# EAGLE schematic Test Machines (EAGLE 9.6.2)
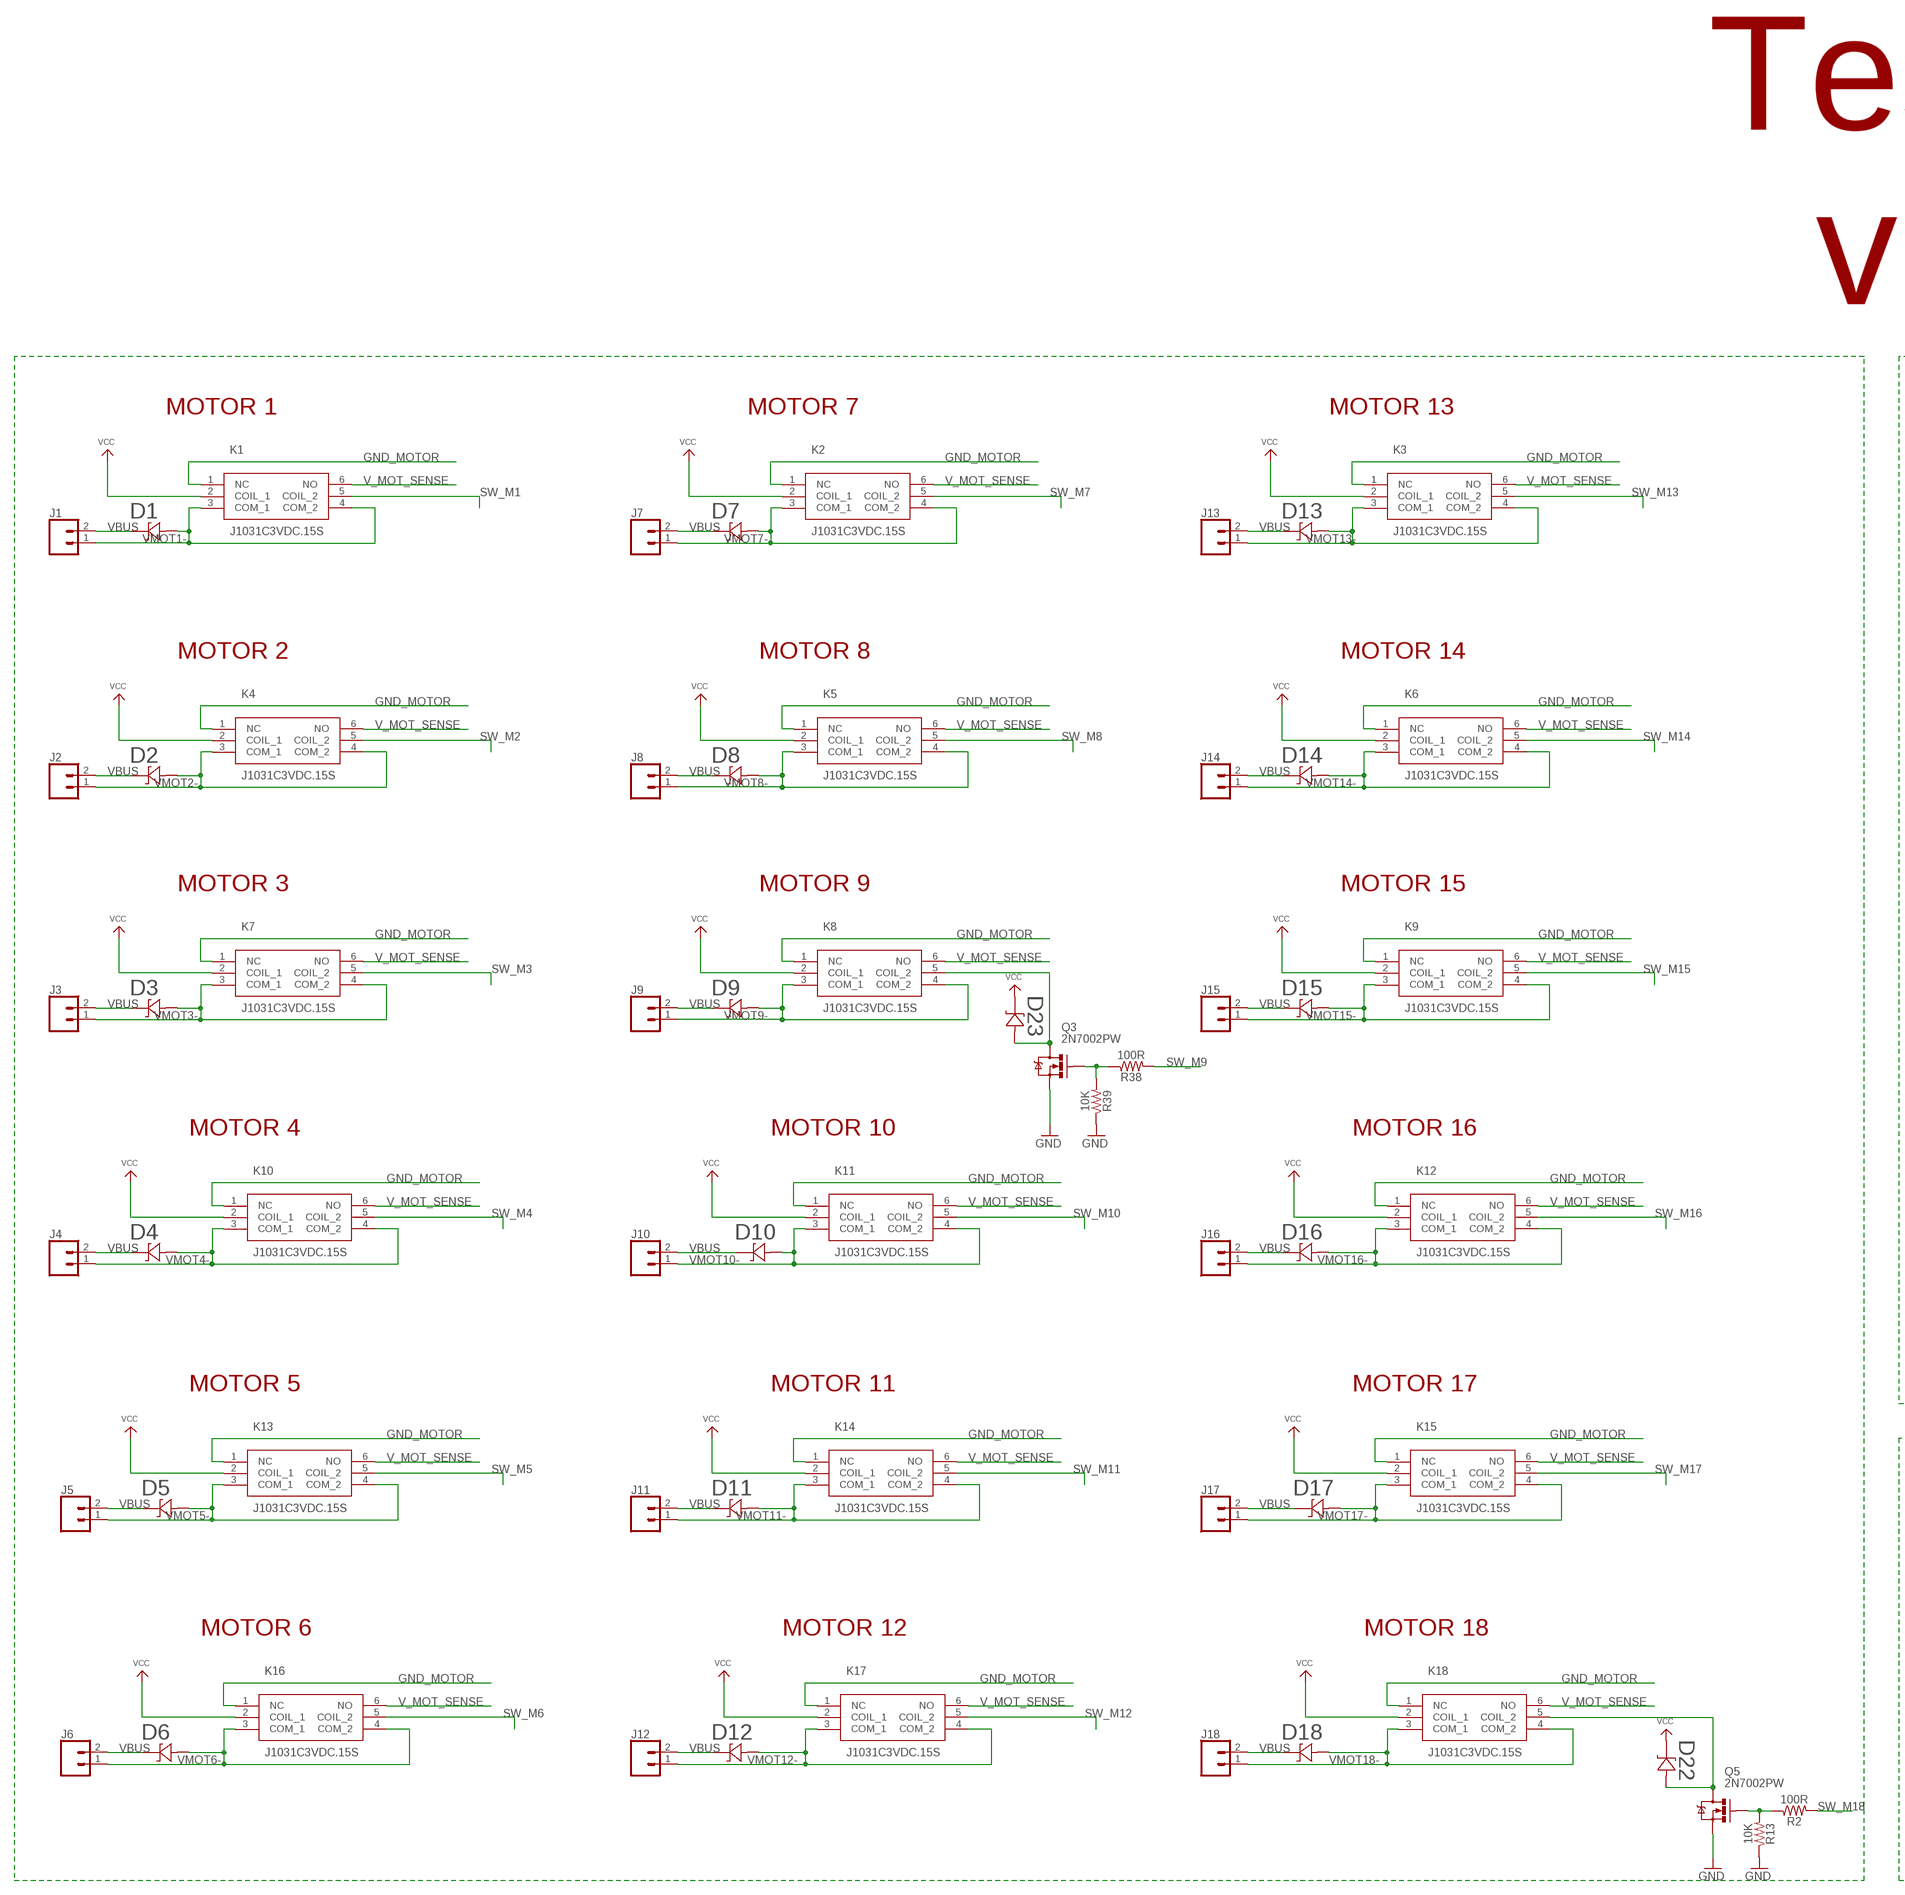
[diagram p0: schematic, sheet 1, part 1 of 3]
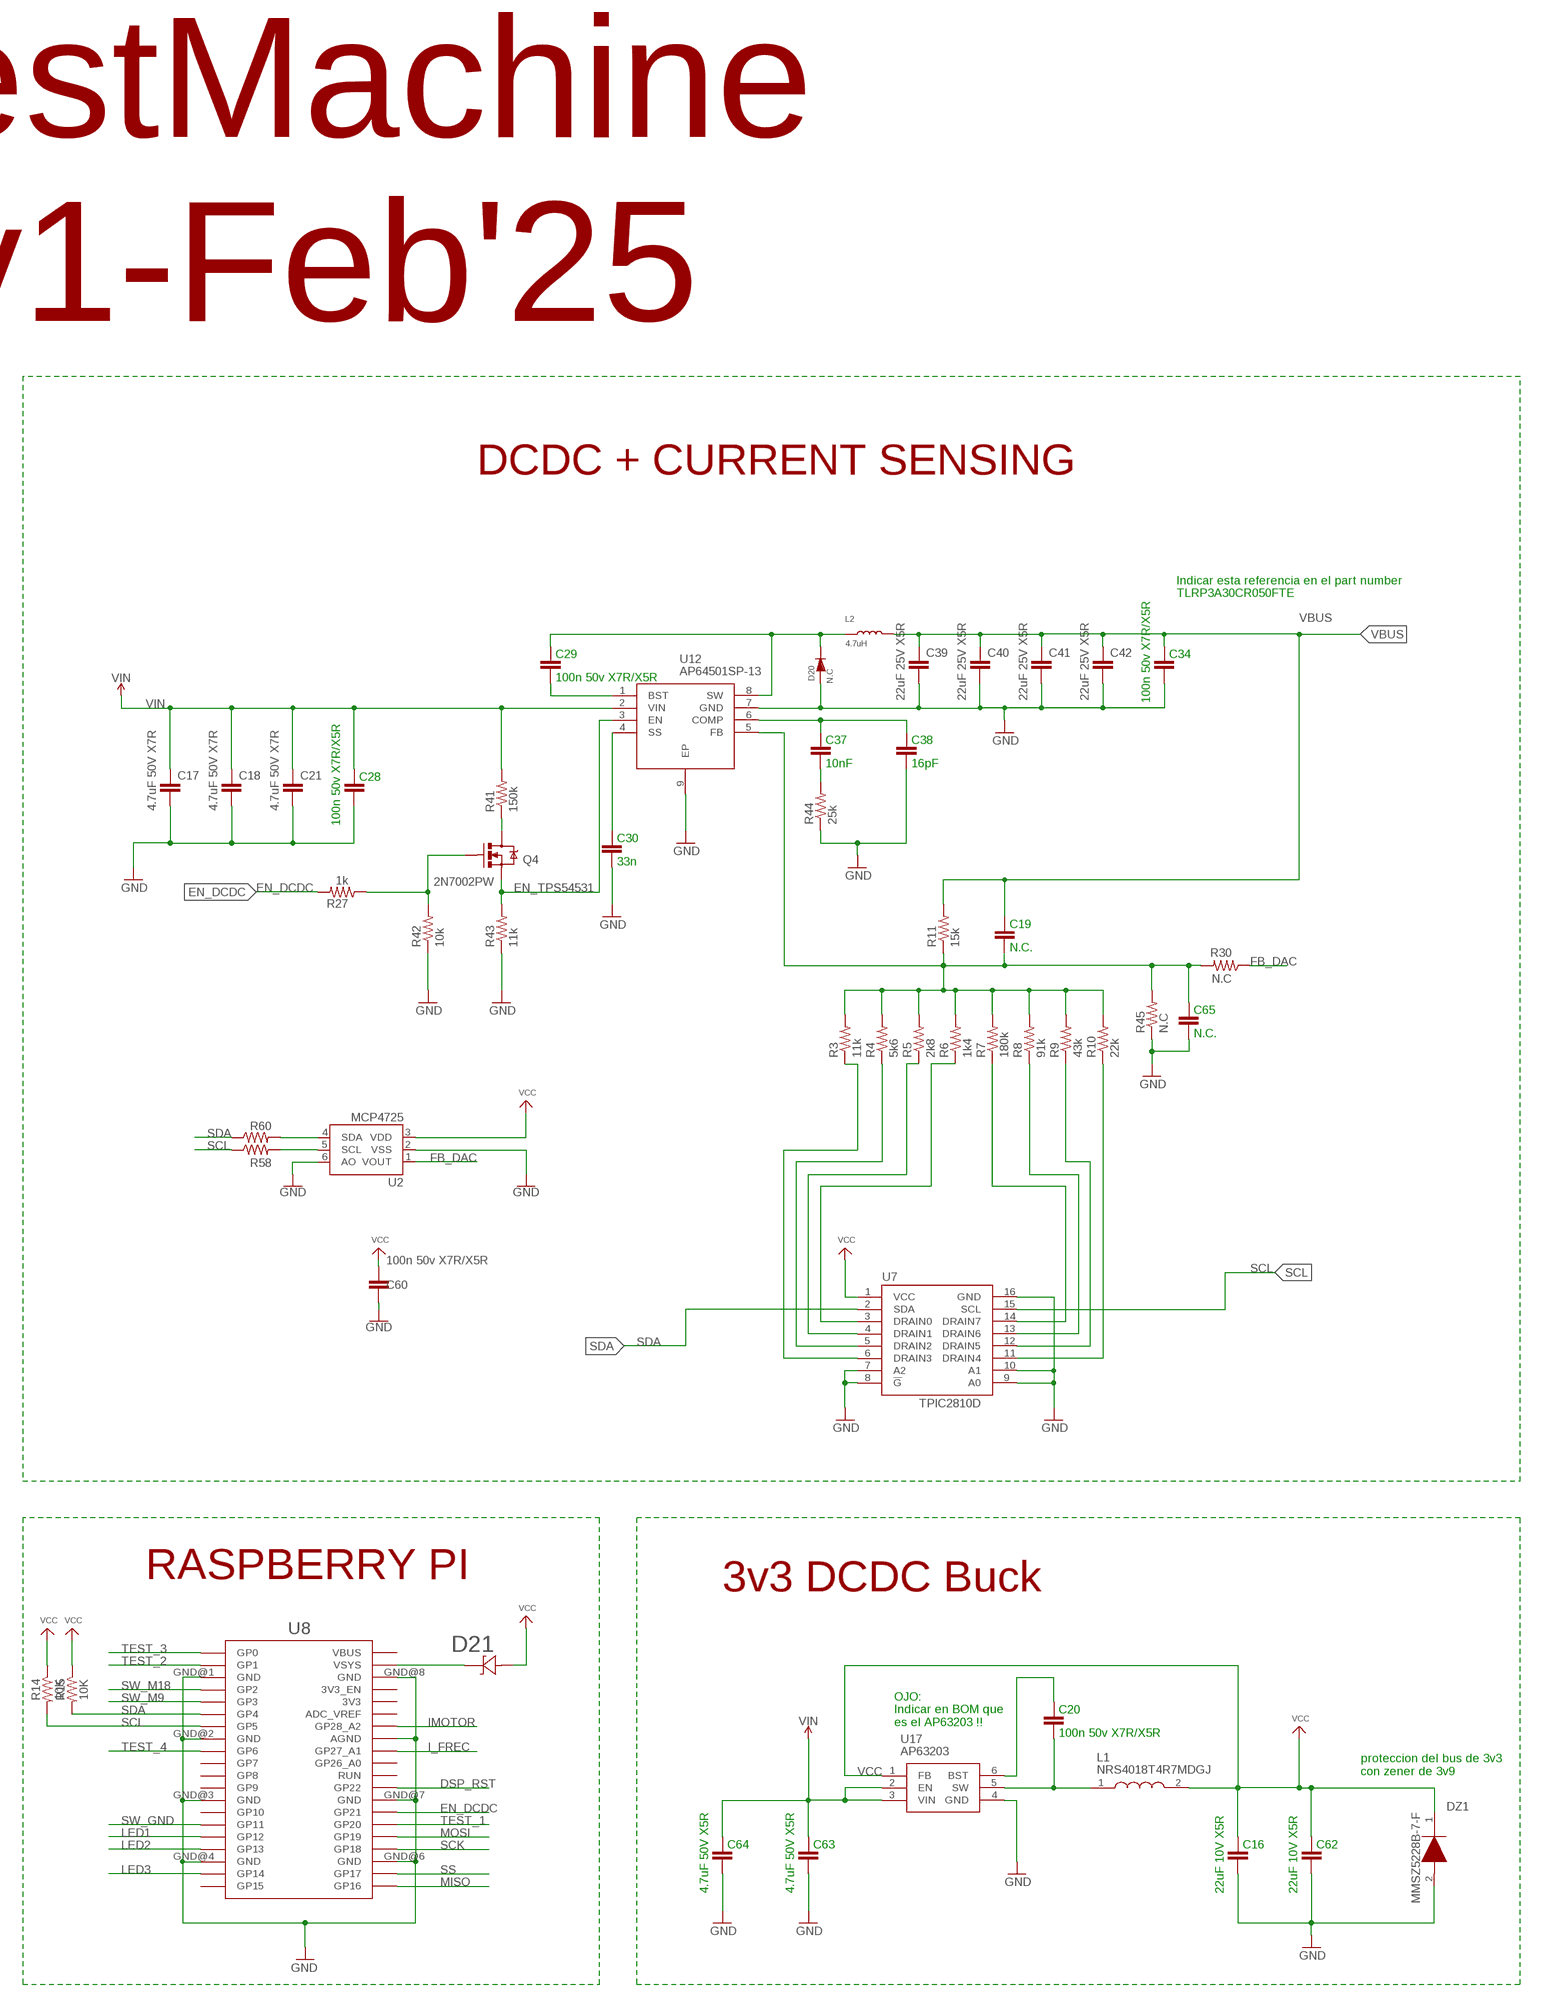
[diagram p1: schematic, sheet 1, part 2 of 3]
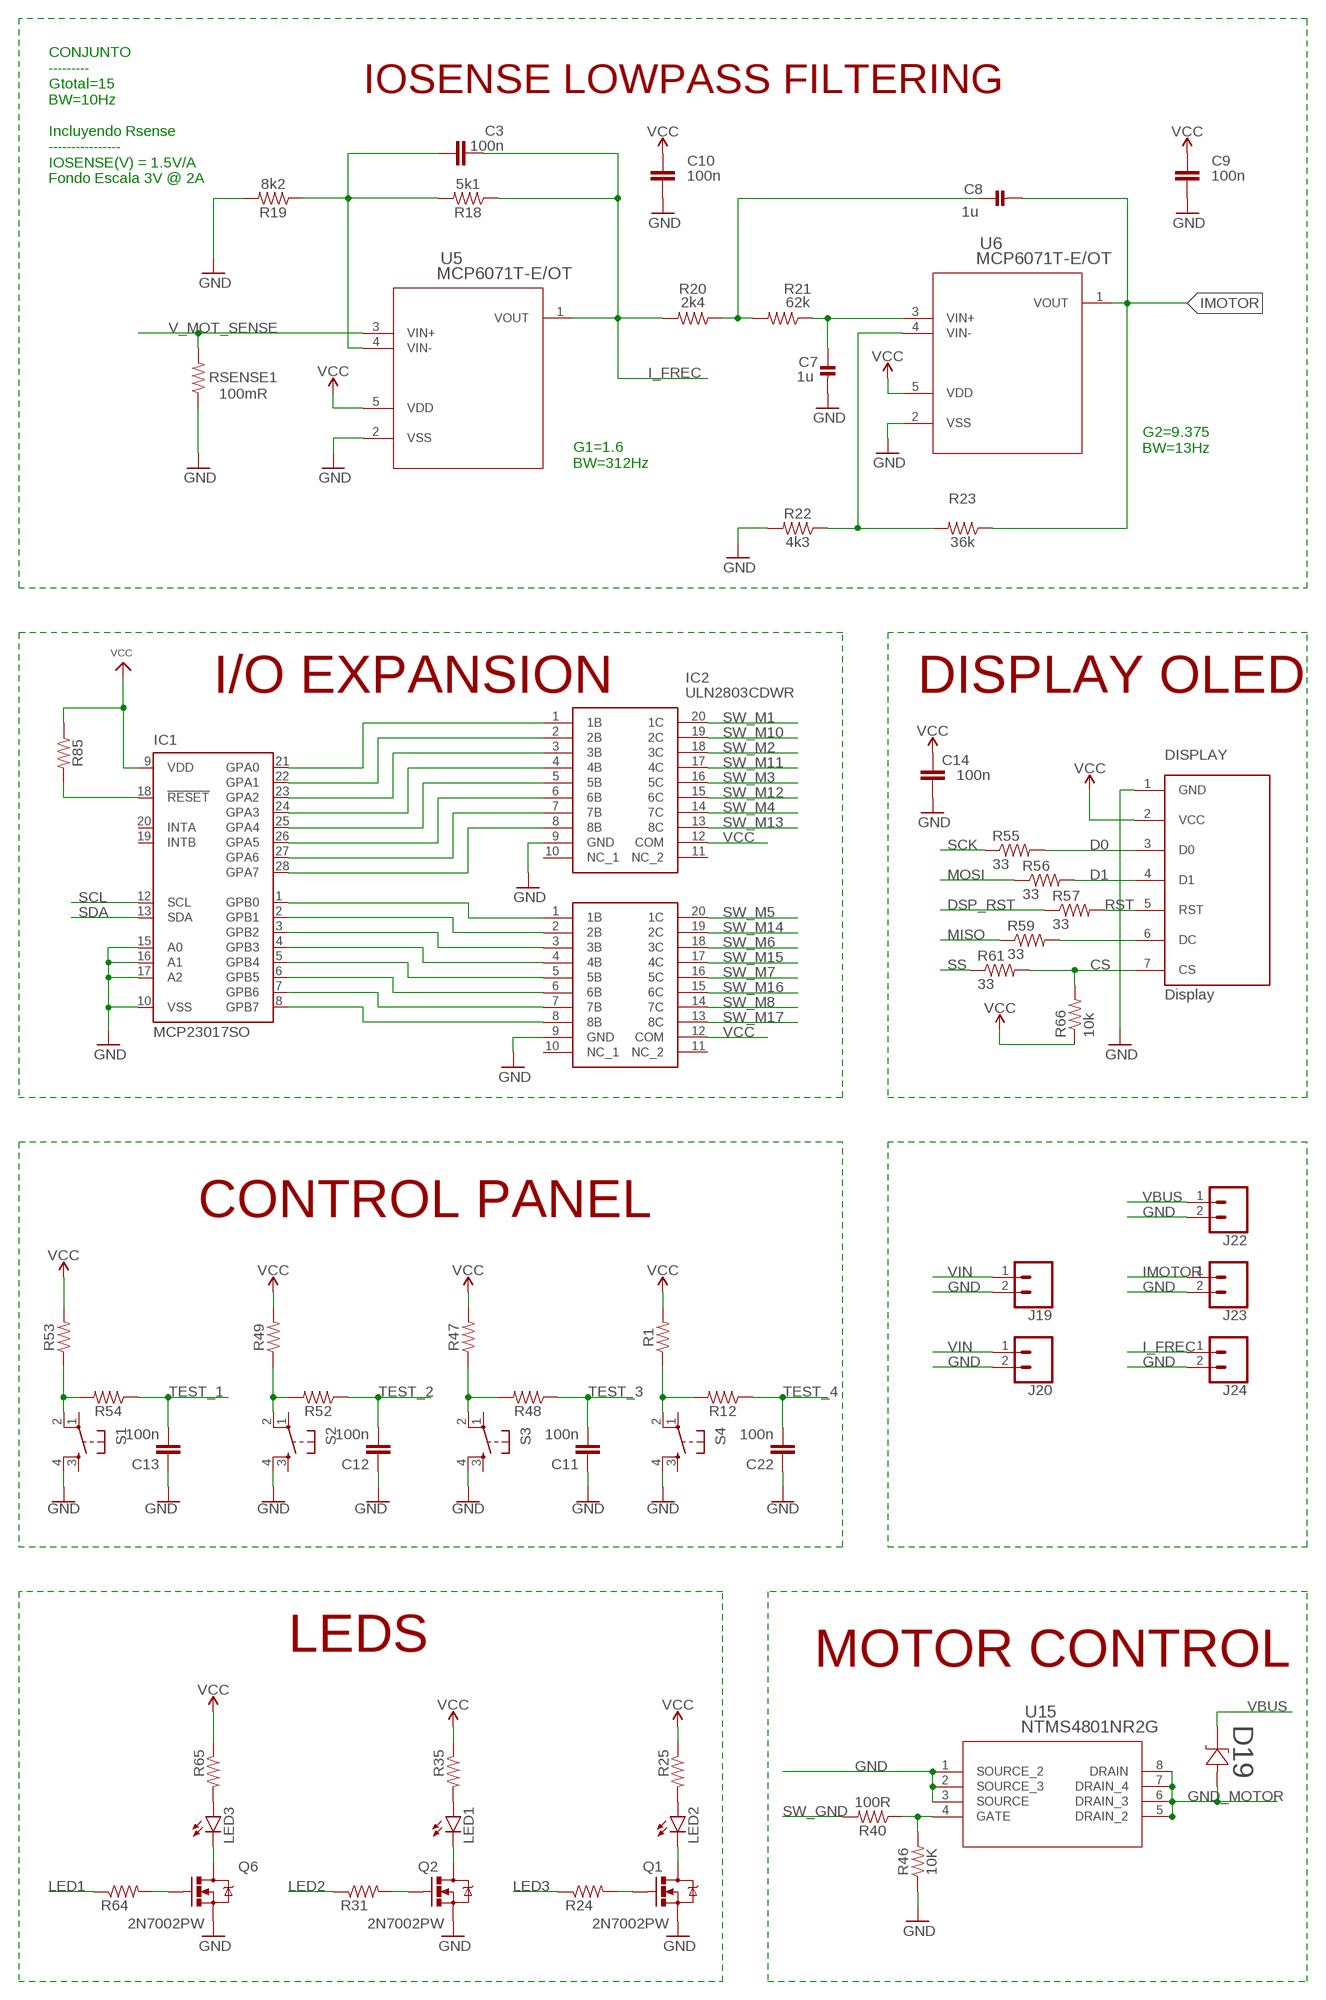
[diagram p2: schematic, sheet 1, part 3 of 3]

## Parts
C3  100n  0.1UF-0603-25V-(+80/-20%)  [0603]
C7  1u  CAP_CERAMIC0603_NO  [0603-NO]
C8  1u  CAP_CERAMIC0603_NO  [0603-NO]
C9  100n  0.1UF-0603-25V-(+80/-20%)  [0603]
C10  100n  0.1UF-0603-25V-(+80/-20%)  [0603]
C11  100n  1.0UF-0805-25V-(+80/-20%)  [0805]
C12  100n  1.0UF-0805-25V-(+80/-20%)  [0805]
C13  100n  1.0UF-0805-25V-(+80/-20%)  [0805]
C14  100n  1.0UF-0805-25V-(+80/-20%)  [0805]
C16  22uF 10V X5R  CAP0805  [0805]
C17  4.7uF 50V X7R  CAP1210  [1210]
C18  4.7uF 50V X7R  CAP1210  [1210]
C19  N.C.  CAP0805  [0805]
C20  100n 50v X7R/X5R  CAP0805  [0805]
C21  4.7uF 50V X7R  CAP1210  [1210]
C22  100n  1.0UF-0805-25V-(+80/-20%)  [0805]
C28  100n 50v X7R/X5R  CAP0805  [0805]
C29  100n 50v X7R/X5R  CAP0805  [0805]
C30  33n  CAP0805  [0805]
C34  100n 50v X7R/X5R  CAP0805  [0805]
C37  10nF  CAP0805  [0805]
C38  16pF  CAP0805  [0805]
C39  22uF 25V X5R  CAP1210  [1210]
C40  22uF 25V X5R  CAP1210  [1210]
C41  22uF 25V X5R  CAP1210  [1210]
C42  22uF 25V X5R  CAP1210  [1210]
C60  100n 50v X7R/X5R  CAP0805  [0805]
C62  22uF 10V X5R  CAP0805  [0805]
C63  4.7uF 50V X5R  CAP0805  [0805]
C64  4.7uF 50V X5R  CAP0805  [0805]
C65  N.C.  CAP0805  [0805]
D1  STPS1L40U  [SMB_STM]
D2  STPS1L40U  [SMB_STM]
D3  STPS1L40U  [SMB_STM]
D4  STPS1L40U  [SMB_STM]
D5  STPS1L40U  [SMB_STM]
D6  STPS1L40U  [SMB_STM]
D7  STPS1L40U  [SMB_STM]
D8  STPS1L40U  [SMB_STM]
D9  STPS1L40U  [SMB_STM]
D10  STPS1L40U  [SMB_STM]
D11  STPS1L40U  [SMB_STM]
D12  STPS1L40U  [SMB_STM]
D13  STPS1L40U  [SMB_STM]
D14  STPS1L40U  [SMB_STM]
D15  STPS1L40U  [SMB_STM]
D16  STPS1L40U  [SMB_STM]
D17  STPS1L40U  [SMB_STM]
D18  STPS1L40U  [SMB_STM]
D19  STPS1L40U  [SMB_STM]
D20  N.C  DSMC  [DO-214AB]
D21  STPS1L40U  [SMB_STM]
D22  STPS1L40U  [SMB_STM]
D23  STPS1L40U  [SMB_STM]
DISPLAY  Display  OLED_LCD  [OLED_LCD]
DZ1  MMSZ5228B-7-F  [SODFL3518X115N]
IC1  MCP23017SO  [SO28W]
IC2  ULN2803CDWR  [SOIC127P1030X265-20N]
IC3  ULN2803CDWR  [SOIC127P1030X265-20N]
J1  CONN_02  [1X02]
J2  CONN_02  [1X02]
J3  CONN_02  [1X02]
J4  CONN_02  [1X02]
J5  CONN_02  [1X02]
J6  CONN_02  [1X02]
J7  CONN_02  [1X02]
J8  CONN_02  [1X02]
J9  CONN_02  [1X02]
J10  CONN_02  [1X02]
J11  CONN_02  [1X02]
J12  CONN_02  [1X02]
J13  CONN_02  [1X02]
J14  CONN_02  [1X02]
J15  CONN_02  [1X02]
J16  CONN_02  [1X02]
J17  CONN_02  [1X02]
J18  CONN_02  [1X02]
J19  CONN_02  [1X02]
J20  CONN_02  [1X02]
J22  CONN_02  [1X02]
J23  CONN_02  [1X02]
J24  CONN_02  [1X02]
K1  J1031C3VDC.15S  [J1031C3VDC15S]
K2  J1031C3VDC.15S  [J1031C3VDC15S]
K3  J1031C3VDC.15S  [J1031C3VDC15S]
K4  J1031C3VDC.15S  [J1031C3VDC15S]
K5  J1031C3VDC.15S  [J1031C3VDC15S]
K6  J1031C3VDC.15S  [J1031C3VDC15S]
K7  J1031C3VDC.15S  [J1031C3VDC15S]
K8  J1031C3VDC.15S  [J1031C3VDC15S]
K9  J1031C3VDC.15S  [J1031C3VDC15S]
K10  J1031C3VDC.15S  [J1031C3VDC15S]
K11  J1031C3VDC.15S  [J1031C3VDC15S]
K12  J1031C3VDC.15S  [J1031C3VDC15S]
K13  J1031C3VDC.15S  [J1031C3VDC15S]
K14  J1031C3VDC.15S  [J1031C3VDC15S]
K15  J1031C3VDC.15S  [J1031C3VDC15S]
K16  J1031C3VDC.15S  [J1031C3VDC15S]
K17  J1031C3VDC.15S  [J1031C3VDC15S]
K18  J1031C3VDC.15S  [J1031C3VDC15S]
L1  NRS4018T4R7MDGJ  [NRS4018T100MDGJ]
L2  4.7uH  L74437368047  [WE-LHMI]
LED1  LED3MM  [LED3MM]
LED2  LED3MM  [LED3MM]
LED3  LED3MM  [LED3MM]
Q1  2N7002PW  MOSFET-NCHANNEL2N7002PW  [SOT323]
Q2  2N7002PW  MOSFET-NCHANNEL2N7002PW  [SOT323]
Q3  2N7002PW  MOSFET-NCHANNEL2N7002PW  [SOT323]
Q4  2N7002PW  MOSFET-NCHANNEL2N7002PW  [SOT323]
Q5  2N7002PW  MOSFET-NCHANNEL2N7002PW  [SOT323]
Q6  2N7002PW  MOSFET-NCHANNEL2N7002PW  [SOT323]
R1  RESISTOR0805  [0805]
R2  100R  RESISTOR0805  [0805]
R3  11k  RESISTOR0805  [0805]
R4  5k6  RESISTOR0805  [0805]
R5  2k8  RESISTOR0805  [0805]
R6  1k4  RESISTOR0805  [0805]
R7  180k  RESISTOR0805  [0805]
R8  91k  RESISTOR0805  [0805]
R9  43k  RESISTOR0805  [0805]
R10  22k  RESISTOR0805  [0805]
R11  15k  RESISTOR0805  [0805]
R12  RESISTOR0805  [0805]
R13  10K  RESISTOR0805  [0805]
R14  10K  RESISTOR0805  [0805]
R15  10K  RESISTOR0805  [0805]
R18  5k1  RESISTOR0805  [0805]
R19  8k2  RESISTOR0805  [0805]
R20  2k4  RESISTOR0805  [0805]
R21  62k  RESISTOR0805  [0805]
R22  4k3  RESISTOR0805  [0805]
R23  36k  RESISTOR0805  [0805]
R24  RESISTOR0805  [0805]
R25  RESISTOR0805  [0805]
R27  1k  RESISTOR0805  [0805]
R30  N.C  RESISTOR0805  [0805]
R31  RESISTOR0805  [0805]
R35  RESISTOR0805  [0805]
R38  100R  RESISTOR0805  [0805]
R39  10K  RESISTOR0805  [0805]
R40  100R  RESISTOR0805  [0805]
R41  150k  RESISTOR0805  [0805]
R42  10k  RESISTOR0805  [0805]
R43  11k  RESISTOR0805  [0805]
R44  25k  RESISTOR0805  [0805]
R45  N.C  RESISTOR0805  [0805]
R46  10K  RESISTOR0805  [0805]
R47  RESISTOR0805  [0805]
R48  RESISTOR0805  [0805]
R49  RESISTOR0805  [0805]
R52  RESISTOR0805  [0805]
R53  RESISTOR0805  [0805]
R54  RESISTOR0805  [0805]
R55  33  RESISTOR0805  [0805]
R56  33  RESISTOR0805  [0805]
R57  33  RESISTOR0805  [0805]
R58  RESISTOR0805  [0805]
R59  33  RESISTOR0805  [0805]
R60  RESISTOR0805  [0805]
R61  33  RESISTOR0805  [0805]
R64  RESISTOR0805  [0805]
R65  RESISTOR0805  [0805]
R66  10k  RESISTOR0805  [0805]
R85  RESISTOR0805  [0805]
RSENSE1  100mR  RESISTOR1206  [1206]
S1  TAC_SWITCH_KSC931G-SMD  [TAC_SW_SMD_KSC931G]
S2  TAC_SWITCH_KSC931G-SMD  [TAC_SW_SMD_KSC931G]
S3  TAC_SWITCH_KSC931G-SMD  [TAC_SW_SMD_KSC931G]
S4  TAC_SWITCH_KSC931G-SMD  [TAC_SW_SMD_KSC931G]
U2  MCP4725  MCP4725SOT-23  [SOT23-6]
U5  MCP6071T-E/OT  [SOT-23-5_MC_MCH]
U6  MCP6071T-E/OT  [SOT-23-5_MC_MCH]
U7  TPIC2810D  [SO16]
U8  RPI_PICO_IG-TH  [RPI_PICO_TH]
U12  AP64501SP-13  [SOIC127P600X163-9N]
U15  NTMS4801NR2G  [SOIC8_4X5_ONS]
U17  AP63203  AP63201WU-7  [SOT95P280X100-6N]

## Nets
CS: DISPLAY.7(CS) R61.2 R66.2
D0: DISPLAY.3(D0) R55.2
D1: DISPLAY.4(D1) R56.2
DSP_RST: R57.1 U8.GP22
EN_DCDC: R27.2 U8.GP21
EN_TPS54531: Q4.2(S) R43.2 U12.3(EN)
FB_DAC: R30.1 U2.1(VOUT)
GND: C7.2 C9.2 C10.2 C11.1 C12.1 C13.1 C14.2 C16.1 C17.2 C18.2 C21.2 C22.1 C28.1 C30.1 C34.1 C38.1 C39.2 C40.2 C41.2 C42.2 C60.1 C62.1 C63.1 C64.1 C65.1 D20.1(A) DISPLAY.1(GND) DZ1.2(A) IC1.10(VSS) IC1.15(A0) IC1.16(A1) IC1.17(A2) IC2.9(GND) IC3.9(GND) J19.2 J20.2 J22.2 J23.2 J24.2 Q1.2(S) Q2.2(S) Q3.2(S) Q5.2(S) Q6.2(S) R13.1 R19.2 R22.2 R39.1 R42.1 R43.1 R44.1 R45.1 R46.1 RSENSE1.1 S1.4 S2.4 S3.4 S4.4 U2.2(VSS) U2.6(AO) U5.2(VSS) U6.2(VSS) U7.7(A2) U7.8(!G) U7.9(A0) U7.10(A1) U7.16(GND) U8.AGND U8.GND@1(GND) U8.GND@2(GND) U8.GND@3(GND) U8.GND@4(GND) U8.GND@6(GND) U8.GND@7(GND) U8.GND@8(GND) U12.7(GND) U12.9(EP) U15.1(SOURCE_2) U15.2(SOURCE_3) U15.3(SOURCE) U17.4(GND)
GND_MOTOR: D19.1 K1.1(NC) K2.1(NC) K3.1(NC) K4.1(NC) K5.1(NC) K6.1(NC) K7.1(NC) K8.1(NC) K9.1(NC) K10.1(NC) K11.1(NC) K12.1(NC) K13.1(NC) K14.1(NC) K15.1(NC) K16.1(NC) K17.1(NC) K18.1(NC) U15.5(DRAIN_2) U15.6(DRAIN_3) U15.7(DRAIN_4) U15.8(DRAIN)
I_FREC: C3.1 J24.1 R18.1 R20.2 U5.1(VOUT) U8.GP27_A1
IMOTOR: C8.2 J23.1 R23.1 U6.1(VOUT) U8.GP28_A2
LED1: R64.1 U8.GP12
LED2: R31.1 U8.GP13
LED3: R24.1 U8.GP14
MISO: R59.1 U8.GP16
MOSI: R56.1 U8.GP19
N$1: R3.1 U7.6(DRAIN3)
N$2: R4.1 U7.5(DRAIN2)
N$3: R5.1 U7.4(DRAIN1)
N$4: R6.1 U7.3(DRAIN0)
N$5: R7.1 U7.14(DRAIN7)
N$7: R8.1 U7.13(DRAIN6)
N$8: R9.1 U7.12(DRAIN5)
N$9: R10.1 U7.11(DRAIN4)
N$10: R1.1 R12.2 S4.2
N$11: LED1.A R35.2
N$12: LED1.K(C) Q2.3(D)
N$13: Q5.1(G) R2.1 R13.2
N$14: D22.1 K18.5(COIL_2) Q5.3(D)
N$15: D23.1 K8.5(COIL_2) Q3.3(D)
N$17: C3.2 R18.2 R19.1 U5.4(VIN-)
N$18: R22.1 R23.2 U6.4(VIN-)
N$19: C19.1 C65.2 R3.2 R4.2 R5.2 R6.2 R7.2 R8.2 R9.2 R10.2 R11.1 R30.2 R45.2 U12.5(FB)
N$20: C8.1 R20.1 R21.2
N$21: Q2.1(G) R31.2
N$22: C7.1 R21.1 U6.3(VIN+)
N$24: Q1.1(G) R24.2
N$25: LED2.A R25.2
N$26: LED2.K(C) Q1.3(D)
N$31: Q3.1(G) R38.1 R39.2
N$34: R40.1 R46.2 U15.4(GATE)
N$35: Q4.3(D) R41.1
N$38: R47.1 R48.2 S3.2
N$39: R49.1 R52.2 S2.2
N$41: R53.1 R54.2 S1.2
N$43: DISPLAY.6(DC) R59.2
N$44: C30.2 U12.4(SS)
N$45: R58.2 U2.5(SCL)
N$47: C29.1 U12.1(BST)
N$48: R60.2 U2.4(SDA)
N$51: C29.2 D20.2(K) L2.1 U12.8(SW)
N$52: C37.2 C38.2 U12.6(COMP)
N$53: C37.1 R44.2
N$56: Q6.1(G) R64.2
N$58: LED3.A R65.2
N$59: LED3.K(C) Q6.3(D)
N$69: C20.2 U17.6(BST)
N$70: C20.1 L1.1 U17.5(SW)
N$75: D21.2 U8.VSYS
N$88: IC1.18(!RESET) R85.2
N$90: IC1.21(GPA0) IC2.1(1B)
N$91: IC1.22(GPA1) IC2.2(2B)
N$92: IC1.23(GPA2) IC2.3(3B)
N$93: IC1.24(GPA3) IC2.4(4B)
N$94: IC1.25(GPA4) IC2.5(5B)
N$95: IC1.26(GPA5) IC2.6(6B)
N$96: IC1.27(GPA6) IC2.7(7B)
N$97: IC1.28(GPA7) IC2.8(8B)
N$98: IC1.1(GPB0) IC3.1(1B)
N$99: IC1.2(GPB1) IC3.2(2B)
N$100: IC1.3(GPB2) IC3.3(3B)
N$101: IC1.4(GPB3) IC3.4(4B)
N$102: IC1.5(GPB4) IC3.5(5B)
N$103: IC1.6(GPB5) IC3.6(6B)
N$104: IC1.7(GPB6) IC3.7(7B)
N$105: IC1.8(GPB7) IC3.8(8B)
RST: DISPLAY.5(RST) R57.2
SAFETY_EN_DCDC: Q4.1(G) R27.1 R42.2
SCK: R55.1 U8.GP18
SCL: IC1.12(SCL) R14.2 R58.1 U7.15(SCL) U8.GP5
SDA: IC1.13(SDA) R15.2 R60.1 U7.2(SDA) U8.GP4
SS: R61.1 U8.GP17
SW_GND: R40.2 U8.GP11
SW_M1: IC2.20(1C) K1.5(COIL_2)
SW_M2: IC2.18(3C) K4.5(COIL_2)
SW_M3: IC2.16(5C) K7.5(COIL_2)
SW_M4: IC2.14(7C) K10.5(COIL_2)
SW_M5: IC3.20(1C) K13.5(COIL_2)
SW_M6: IC3.18(3C) K16.5(COIL_2)
SW_M7: IC3.16(5C) K2.5(COIL_2)
SW_M8: IC3.14(7C) K5.5(COIL_2)
SW_M9: R38.2 U8.GP3
SW_M10: IC2.19(2C) K11.5(COIL_2)
SW_M11: IC2.17(4C) K14.5(COIL_2)
SW_M12: IC2.15(6C) K17.5(COIL_2)
SW_M13: IC2.13(8C) K3.5(COIL_2)
SW_M14: IC3.19(2C) K6.5(COIL_2)
SW_M15: IC3.17(4C) K9.5(COIL_2)
SW_M16: IC3.15(6C) K12.5(COIL_2)
SW_M17: IC3.13(8C) K15.5(COIL_2)
SW_M18: R2.2 U8.GP2
TEST_1: C13.2 R54.1 U8.GP20
TEST_2: C12.2 R52.1 U8.GP1
TEST_3: C11.2 R48.1 U8.GP0
TEST_4: C22.2 R12.1 U8.GP6
V_MOT_SENSE: K1.6(NO) K2.6(NO) K3.6(NO) K4.6(NO) K5.6(NO) K6.6(NO) K7.6(NO) K8.6(NO) K9.6(NO) K10.6(NO) K11.6(NO) K12.6(NO) K13.6(NO) K14.6(NO) K15.6(NO) K16.6(NO) K17.6(NO) K18.6(NO) RSENSE1.2 U5.3(VIN+)
VBUS: C19.2 C34.2 C39.1 C40.1 C41.1 C42.1 D1.2 D2.2 D3.2 D4.2 D5.2 D6.2 D7.2 D8.2 D9.2 D10.2 D11.2 D12.2 D13.2 D14.2 D15.2 D16.2 D17.2 D18.2 D19.2 J1.2 J2.2 J3.2 J4.2 J5.2 J6.2 J7.2 J8.2 J9.2 J10.2 J11.2 J12.2 J13.2 J14.2 J15.2 J16.2 J17.2 J18.2 J22.1 L2.2 R11.2
VCC: C9.1 C10.1 C14.1 C16.2 C60.2 C62.2 D21.1 D22.2 D23.2 DISPLAY.2(VCC) DZ1.1(K) IC1.9(VDD) IC2.12(COM) IC3.12(COM) K1.2(COIL_1) K2.2(COIL_1) K3.2(COIL_1) K4.2(COIL_1) K5.2(COIL_1) K6.2(COIL_1) K7.2(COIL_1) K8.2(COIL_1) K9.2(COIL_1) K10.2(COIL_1) K11.2(COIL_1) K12.2(COIL_1) K13.2(COIL_1) K14.2(COIL_1) K15.2(COIL_1) K16.2(COIL_1) K17.2(COIL_1) K18.2(COIL_1) L1.2 R1.2 R14.1 R15.1 R25.1 R35.1 R47.2 R49.2 R53.2 R65.1 R66.1 R85.1 U2.3(VDD) U5.5(VDD) U6.5(VDD) U7.1(VCC) U17.1(FB)
VIN: C17.1 C18.1 C21.1 C28.2 C63.2 C64.2 J19.1 J20.1 R41.2 U12.2(VIN) U17.2(EN) U17.3(VIN)
VMOT1-: D1.1 J1.1 K1.3(COM_1) K1.4(COM_2)
VMOT2-: D2.1 J2.1 K4.3(COM_1) K4.4(COM_2)
VMOT3-: D3.1 J3.1 K7.3(COM_1) K7.4(COM_2)
VMOT4-: D4.1 J4.1 K10.3(COM_1) K10.4(COM_2)
VMOT5-: D5.1 J5.1 K13.3(COM_1) K13.4(COM_2)
VMOT6-: D6.1 J6.1 K16.3(COM_1) K16.4(COM_2)
VMOT7-: D7.1 J7.1 K2.3(COM_1) K2.4(COM_2)
VMOT8-: D8.1 J8.1 K5.3(COM_1) K5.4(COM_2)
VMOT9-: D9.1 J9.1 K8.3(COM_1) K8.4(COM_2)
VMOT10-: D10.1 J10.1 K11.3(COM_1) K11.4(COM_2)
VMOT11-: D11.1 J11.1 K14.3(COM_1) K14.4(COM_2)
VMOT12-: D12.1 J12.1 K17.3(COM_1) K17.4(COM_2)
VMOT13-: D13.1 J13.1 K3.3(COM_1) K3.4(COM_2)
VMOT14-: D14.1 J14.1 K6.3(COM_1) K6.4(COM_2)
VMOT15-: D15.1 J15.1 K9.3(COM_1) K9.4(COM_2)
VMOT16-: D16.1 J16.1 K12.3(COM_1) K12.4(COM_2)
VMOT17-: D17.1 J17.1 K15.3(COM_1) K15.4(COM_2)
VMOT18-: D18.1 J18.1 K18.3(COM_1) K18.4(COM_2)
Unconnected: IC1.19(INTB) IC1.20(INTA) IC2.10(NC_1) IC2.11(NC_2) IC3.10(NC_1) IC3.11(NC_2) S1.1 S1.3 S2.1 S2.3 S3.1 S3.3 S4.1 S4.3 U8.3V3 U8.3V3_EN U8.ADC_VREF U8.GP7 U8.GP8 U8.GP9 U8.GP10 U8.GP15 U8.GP26_A0 U8.RUN U8.VBUS

## Notes on the sheet
- TestMachine
  v1-Feb'25
- MOTOR 1 | MOTOR 7 | MOTOR 13 | IOSENSE LOWPASS FILTERING
- DCDC + CURRENT SENSING
- CONJUNTO
  ---------
  Gtotal=15
  BW=10Hz
  
  Incluyendo Rsense
  ----------------
  IOSENSE(V) = 1.5V/A
  Fondo Escala 3V @ 2A
- Indicar esta referencia en el part number
  TLRP3A30CR050FTE
- MOTOR 2 | MOTOR 8 | MOTOR 14
- G2=9.375
  BW=13Hz
- G1=1.6
  BW=312Hz
- I/O EXPANSION | DISPLAY OLED
- MOTOR 3 | MOTOR 9 | MOTOR 15
- MOTOR 4 | MOTOR 10 | MOTOR 16
- CONTROL PANEL
- MOTOR 5 | MOTOR 11 | MOTOR 17
- RASPBERRY PI | 3v3 DCDC Buck
- LEDS
- MOTOR 6 | MOTOR 12 | MOTOR 18
- OJO:
  Indicar en BOM que 
  es el AP63203 !!
- MOTOR CONTROL
- proteccion del bus de 3v3
  con zener de 3v9

## Library data of the parts
C3 C9 C10 = SparkFun-Capacitors:0.1UF: 0.1µF ceramic capacitors A capacitor is a passive two-terminal electrical component used to store electrical energy temporarily in an electric field.; PROD_ID: CAP-00810; VALUE: 0.1uF
C7 C8 = microbuilder:CAP_CERAMIC: Ceramic Capacitors For new designs, use the packages preceded by an '_' character since they are more reliable: The following footprints should be used on most boards: _0402 - Standard footprint for regular board layouts _0603 - Standard footprint for regular board layouts _0805 - Standard footprint for regular board layouts _1206 - Standard footprint for regular board layouts For extremely tight-pitch boards where space is at a premium, the following 'micro-pitch' footprints can be used (smaller pads, no silkscreen outline, etc.): _0402MP - Micro-pitch footprint for very dense/compact boards _0603MP - Micro-pitch footprint for very dense/compact boards _0805MP - Micro-pitch footprint for very dense/compact boards _1206MP - Micro-pitch footprint for very dense/compact boards
C11-C14 C22 = SparkFun-Capacitors:1.0UF: 1µF ceramic capacitors A capacitor is a passive two-terminal electrical component used to store electrical energy temporarily in an electric field.; PROD_ID: CAP-11625; VALUE: 1.0uF
C16-C21 C28-C30 C34 C37-C42 C60 C62-C65 = SparkFun-Passives:CAP: Capacitor Standard 0603 ceramic capacitor, and 0.1" leaded capacitor.
D1-D19 D21-D23 = STPS1L40U:STPS1L40U; COPYRIGHT: Copyright (C) 2024 Ultra Librarian. All rights reserved.; MANUFACTURER_PART_NUMBER: STPS1L40U; MFR_NAME: STMicroelectronics
D20 = EDCPSU - Rev3:D*
DISPLAY = EDCPSU:OLED_LCD
DZ1 = MMSZ5228B-7-F:MMSZ5228B-7-F: Diodes Inc MMSZ5228B-7-F Zener Diode, 3.9V 5% 500 mW SMT 2-Pin SOD-123 Source: Datasheet <http://au.rs-online.com/web/p/products/8231502P>; DESCRIPTION: Diodes Inc MMSZ5228B-7-F Zener Diode, 3.9V 5% 500 mW SMT 2-Pin SOD-123; HEIGHT: 1.15mm; MANUFACTURER_NAME: Diodes Inc.; MANUFACTURER_PART_NUMBER: MMSZ5228B-7-F
IC1 = adafruit:MCP23017: http://ww1.microchip.com/downloads/en/DeviceDoc/21952a.pdf Source: http://ww1.microchip.com/downloads/en/DeviceDoc/21952a.pdf
IC2 IC3 = SamacSys_Parts:ULN2803CDWR: Bipolar (BJT) Transistor Array 8 NPN Darlington 50V 500mA Surface Mount 20-SOIC Source: Datasheet <https://www.ti.com/lit/ds/symlink/uln2803c.pdf?ts=1664254346163&ref_url=https%3A%2F%2Fwww.ti.com%2Fproduct%2FULN2803C%3FkeyMatch%3DULN2803C%26tisearch%3Dsearch-everything%26usecase%3DGPN>; ARROW_PART_NUMBER: ULN2803CDWR; ARROW_PRICE-STOCK: https://www.arrow.com/en/products/uln2803cdwr/texas-instruments?region=nac; DESCRIPTION: Bipolar (BJT) Transistor Array 8 NPN Darlington 50V 500mA Surface Mount 20-SOIC; HEIGHT: 2.65mm; MANUFACTURER_NAME: Texas Instruments; MANUFACTURER_PART_NUMBER: ULN2803CDWR; MOUSER_PART_NUMBER: 595-ULN2803CDWR; MOUSER_PRICE-STOCK: https://www.mouser.co.uk/ProductDetail/Texas-Instruments/ULN2803CDWR?qs=vvQtp7zwQdMA2JP56CSJyQ%3D%3D
J1-J20 J22-J24 = SparkFun-Connectors:CONN_02: Multi connection point. Often used as Generic Header-pin footprint for 0.1 inch spaced/style header connections On any of the 0.1 inch spaced packages, you can populate with these: Break Away Headers - Straight <https://www.sparkfun.com/products/116> (PRT-00116) Break Away Male Headers - Right Angle <https://www.sparkfun.com/products/553> (PRT-00553) Female Headers <https://www.sparkfun.com/products/115> (PRT-00115) Break Away Headers - Machine Pin <https://www.sparkfun.com/products/117> (PRT-00117) Break Away Female Headers - Swiss Machine Pin <https://www.sparkfun.com/products/743> (PRT-00743) For SCREWTERMINALS and SPRING TERMINALS visit here: Screw Terimnals on SparkFun.com <https://www.sparkfun.com/search/results?term=Screw+Terminals> (5mm/3.5mm/2.54mm spacing) This device is also useful as a general connection point to wire up your design to another part of your project. Our various solder wires solder well into these plated through hole pads. Hook-Up Wire - Assortment (Stranded, 22 AWG) <https://www.sparkfun.com/products/11375> (PRT-11375) Hook-Up Wire - Assortment (Solid Core, 22 AWG) <https://www.sparkfun.com/products/11367> (PRT-11367) View the entire wire category on our website here <https://www.sparkfun.com/categories/141> Special notes: Molex polarized connector foot print use with: PRT-08233 with associated crimp pins and housings. 2.54_SCREWTERM for use with PRT-10571. 3.5mm Screw Terminal footprints for PRT-08084 5mm Screw Terminal footprints for use with PRT-08432
K1-K18 = SamacSys_Parts:J1031C3VDC.15S: General Purpose Relay SPDT (1 Form C) Through Hole Source: Datasheet <https://www.citrelay.com/Catalog Pages/RelayCatalog/J103.pdf>; DESCRIPTION: General Purpose Relay SPDT (1 Form C) Through Hole; HEIGHT: 9.85mm; MANUFACTURER_NAME: CIT Relay & Switch; MANUFACTURER_PART_NUMBER: J1031C3VDC.15S
L1 = NRS4018T4R7MDGJ:NRS4018T4R7MDGJ: Inductor SMD wirewound 4.7uH Source: Datasheet <https://datasheet.datasheetarchive.com/originals/distributors/Datasheets-DGA11/2190982.pdf>; ARROW_PART_NUMBER: NRS4018T4R7MDGJ; ARROW_PRICE-STOCK: https://www.arrow.com/en/products/nrs4018t4r7mdgj/taiyo-yuden; DESCRIPTION: Inductor SMD wirewound 4.7uH; HEIGHT: 1mm; MANUFACTURER_NAME: TAIYO YUDEN; MANUFACTURER_PART_NUMBER: NRS4018T4R7MDGJ; MOUSER_PART_NUMBER: 963-NRS4018T4R7MDGJ; MOUSER_PRICE-STOCK: https://www.mouser.co.uk/ProductDetail/Taiyo-Yuden/NRS4018T4R7MDGJ?qs=PzICbMaShUfBUWy4ytltsA%3D%3D
L2 = EDCPSU - Rev3:L*
LED1-LED3 = SparkFun-LED:LED: LEDs Standard schematic elements and footprints for 5mm, 3mm, 1206, and 0603 sized LEDs. 5mm - Spark Fun Electronics SKU : COM-00529 (and others)
Q1-Q6 = SparkFun-DiscreteSemi:MOSFET-NCHANNEL: Common NMOSFET Parts MFG P/N Store ID Prod ID FDD8780 TRANS-09984 SI7820DN TRANS-11055 FDS6630A IC-08089 2N7002PW TRANS-11151 FQP30N06L COM-10213 TRANS-10060 BSS123LT1G TRANS-08345 BSS138 TRANS-00830 BS170 2N7000; PROD_ID: TRANS-11151
R1-R15 R18-R25 R27 R30 R31 R35 R38-R49 R52-R61 R64-R66 R85 RSENSE1 = SparkFun-Resistors:RESISTOR: Generic Resistor Package
S1-S4 = EDCPSU - Rev2:TAC_SWITCH: Momentary Switch Button commonly used for reset or general input. Spark Fun Electronics SKU : COM-00097 SMT- SWCH-08247
U2 = SparkFun-IC-Conversion:MCP4725: MCP4725 DAC Microchip 12-bit I2C DAC, SOT23-6 Datasheet <https://cdn.sparkfun.com/datasheets/BreakoutBoards/MCP4725_2009.pdf> SparkFun Products SparkFun I2C DAC Breakout - MCP4725 <https://www.sparkfun.com/products/12918> (BOB-12918); PROD_ID: IC-08886
U5 U6 = MCP6071:MCP6071T-E/OT; BUILT_BY: EMA_Jessica; COPYRIGHT: Copyright (C) 2018 Accelerated Designs. All rights reserved; MANUFACTURER_PART_NUMBER: MCP6071T-E/OT; SOURCELIBRARY: Microchip_2019-08-23_21; VENDOR: Microchip
U7 = EDCPSU - Rev2:TPIC2810D
U8 = RaspberryPi_Pico:RPI_PICO_IG
U12 = AP64501SP-13:AP64501SP-13: Conv DC-DC 3.8V to 40V Synchronous Step Down Single-Out 0.8V to 39V 5A 8-Pin SO EP T/R Source: Datasheet <https://www.arrow.com/en/products/ap64501sp-13/diodes-incorporated>; ARROW_PART_NUMBER: AP64501SP-13; ARROW_PRICE-STOCK: https://www.arrow.com/en/products/ap64501sp-13/diodes-incorporated?region=nac; DESCRIPTION: Conv DC-DC 3.8V to 40V Synchronous Step Down Single-Out 0.8V to 39V 5A 8-Pin SO EP T/R; HEIGHT: 1.63mm; MANUFACTURER_NAME: Diodes Inc.; MANUFACTURER_PART_NUMBER: AP64501SP-13; MOUSER_PART_NUMBER: 621-AP64501SP-13; MOUSER_PRICE-STOCK: https://www.mouser.co.uk/ProductDetail/Diodes-Incorporated/AP64501SP-13?qs=P1JMDcb91o7FS0GU%252BW7TIQ%3D%3D
U15 = NTMS4801NR2G:NTMS4801NR2G; COPYRIGHT: Copyright (C) 2024 Ultra Librarian. All rights reserved.; MANUFACTURER_PART_NUMBER: NTMS4801NR2G; MFR_NAME: onsemi
U17 = AP63201WU-7:AP63201WU-7: Switching Voltage Regulators DCDC Conv HV Buck TSOT26 T&R 3K Source: Datasheet <https://mouser.componentsearchengine.com/Datasheets/1/AP63201WU-7.pdf>; ARROW_PART_NUMBER: AP63201WU-7; ARROW_PRICE-STOCK: https://www.arrow.com/en/products/ap63201wu-7/diodes-incorporated?region=nac; DESCRIPTION: Switching Voltage Regulators DCDC Conv HV Buck TSOT26 T&R 3K; HEIGHT: 1mm; MANUFACTURER_NAME: Diodes Inc.; MANUFACTURER_PART_NUMBER: AP63201WU-7; MOUSER_PART_NUMBER: 621-AP63201WU-7; MOUSER_PRICE-STOCK: https://www.mouser.co.uk/ProductDetail/Diodes-Incorporated/AP63201WU-7?qs=u16ybLDytRaVD%252BU3eG30NA%3D%3D